# EAGLE design Sega Master System Quick Solder BIOS v1p1 (EAGLE 9.6.2)
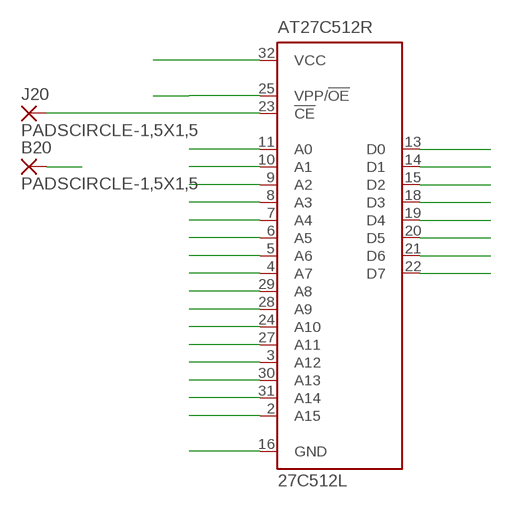
[diagram p0: schematic, sheet 1]

## Parts
AT27C512R  27C512L  [PLCC-32]
B20  PADSCIRCLE-1,5X1,5  [CIRCLE-1,5X1,5]
J20  PADSCIRCLE-1,5X1,5  [CIRCLE-1,5X1,5]

## Nets
A0: AT27C512R.11(A0)
A1: AT27C512R.10(A1)
A2: AT27C512R.9(A2)
A3: AT27C512R.8(A3)
A4: AT27C512R.7(A4)
A5: AT27C512R.6(A5)
A6: AT27C512R.5(A6)
A7: AT27C512R.4(A7)
A8: AT27C512R.29(A8)
A9: AT27C512R.28(A9)
A10: AT27C512R.24(A10)
A11: AT27C512R.27(A11)
A12: AT27C512R.3(A12)
A13: AT27C512R.30(A13)
A14: AT27C512R.31(A14)
A15: AT27C512R.2(A15)
CE-B20: B20.1(P)
CE-J20: AT27C512R.23(!CE) J20.1(P)
GND: AT27C512R.16(GND)
O0: AT27C512R.13(D0)
O1: AT27C512R.14(D1)
O2: AT27C512R.15(D2)
O3: AT27C512R.18(D3)
O4: AT27C512R.19(D4)
O5: AT27C512R.20(D5)
O6: AT27C512R.21(D6)
O7: AT27C512R.22(D7)
OE/VPP: AT27C512R.25(VPP/!OE)
VCC: AT27C512R.32(VCC)

## Library data of the parts
AT27C512R = Consoles Unleashed Eagle Parts Library:27*512: CMOS EPROM 512 K (64 K x 8); MPN: M27C512-90C1; OC_FARNELL: 1218315; OC_NEWARK: 24M5090
B20 J20 = Consoles Unleashed Eagle Parts Library:PADS: PADS connect wires to PCB

## Board
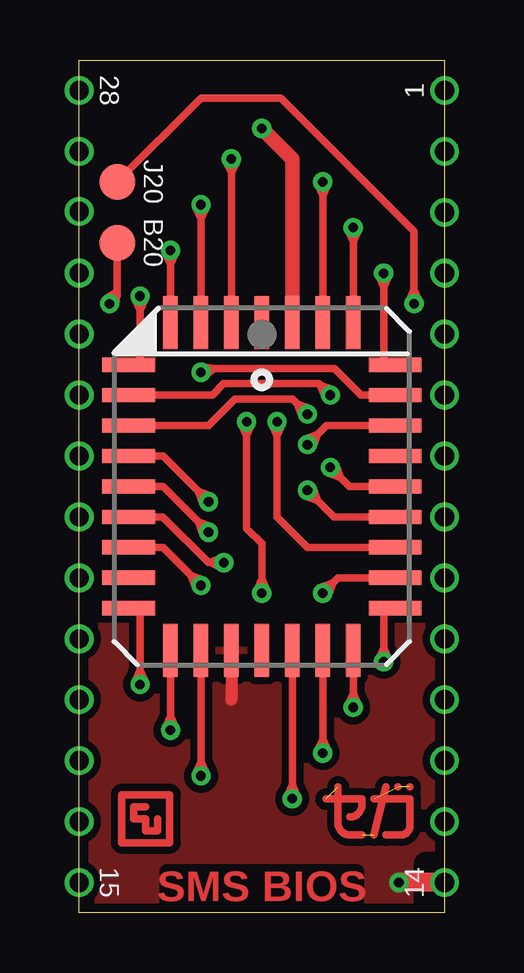
[diagram p1: board, top side]
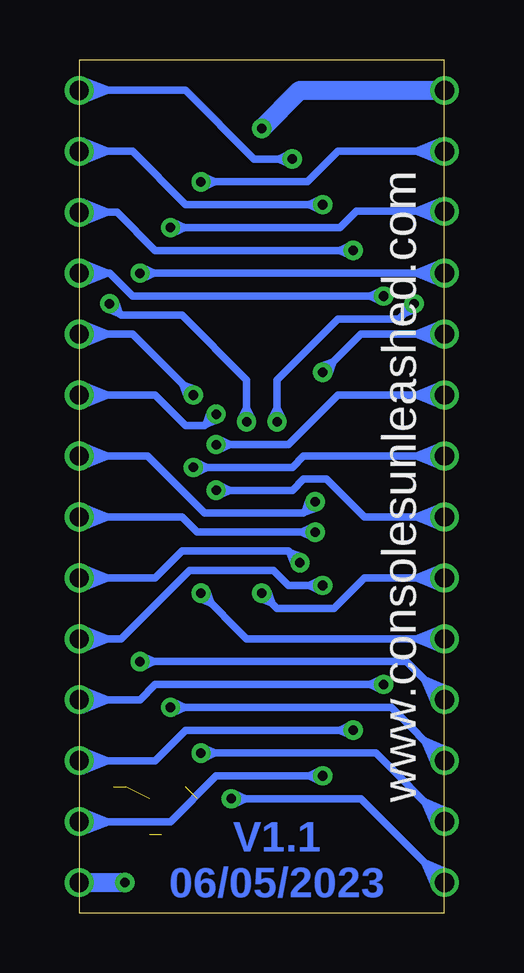
[diagram p2: board, bottom side, seen from below]

Size 15.24 x 35.56 mm. Coordinates in mm from the lower left corner, seen from the top.
Outline: 0,35.56 15.24,35.56 15.24,0 0,0 0,35.56
Copper layers (1*16): Top 0.035559375mm / dielectric 1.6mm / Bottom 0.035559375mm
Design rules "oshpark-2layer *": minimum track width 6mil, minimum drill 10mil, track to track 6mil, track to pad 6mil, pad to pad 6mil, via to via 6mil, smd to smd 6mil, copper to edge 15mil, drill to drill 6mil, minimum pad ring 5mil, minimum via ring 5mil, stop-mask expansion 2.5mil, vias tented up to drill 0.7mm, thermal gap 12mil

### Footprints (pad centres in the part's own frame; a part is rotated, then mirrored left to right if it is on the bottom)
PLCC-32 = smd 2.2 x 0.6: 1 -6.83,0; 2 -6.83,-1.27; 3 -6.83,-2.54; 4 -6.83,-3.81; 14 6.83,-3.81; 15 6.83,-2.54; 16 6.83,-1.27; 17 6.83,0; 18 6.83,1.27; 19 6.83,2.54; 20 6.83,3.81; 30 -6.83,3.81; 31 -6.83,2.54; 32 -6.83,1.27 | smd 0.6 x 2.2: 5 -5.08,-5.56; 6 -3.81,-5.56; 7 -2.54,-5.56; 8 -1.27,-5.56; 9 0,-5.56; 10 1.27,-5.56; 11 2.54,-5.56; 12 3.81,-5.56; 13 5.08,-5.56; 21 5.08,5.56; 22 3.81,5.56; 23 2.54,5.56; 24 1.27,5.56; 25 0,5.56; 26 -1.27,5.56; 27 -2.54,5.56; 28 -3.81,5.56; 29 -5.08,5.56
CIRCLE-1,5X1,5 = smd 1.5 x 1.5: 1 0,0

### Placement (x,y rotation side)
AT27C512R  7.62,17.78 270 top
B20  1.59,27.94 0 top
J20  1.59,30.48 0 top

### Tracks (layer width: path | path; a pad name or v marks a point on that pad's centre or on a via)
A0  (via drill 0.4 pad 0.8, 0.8 pad 1.2)
  Top 0.305: v5.08,13.65 3.49,15.24 AT27C512R.11 | v5.08,13.65 4.85,13.56 4.66,14.08 5.17,13.88 v5.08,13.65
  Bottom 0.305: v15.24,11.43 13.49,11.43 10.64,14.29 7.14,14.29 6.51,13.65 v5.08,13.65 | v5.08,13.65 5.18,13.88 5.68,13.65 5.18,13.43 v5.08,13.65 | v15.24,11.43 15.07,11.02 14.04,11.43 15.07,11.85 v15.24,11.43
A1  (via drill 0.4 pad 0.8, 0.8 pad 1.2)
  Top 0.305: v6.03,14.61 5.39,14.61 3.49,16.51 AT27C512R.10 | v6.03,14.61 5.93,14.38 5.43,14.61 5.93,14.83 v6.03,14.61
  Bottom 0.305: v15.24,13.97 12.06,13.97 10.95,15.08 6.51,15.08 v6.03,14.61 | v6.03,14.61 5.95,14.84 6.46,15.03 6.26,14.52 v6.03,14.61 | v15.24,13.97 15.07,13.55 14.04,13.97 15.07,14.38 v15.24,13.97
A2  (via drill 0.4 pad 0.8, 0.8 pad 1.2)
  Top 0.305: v5.4,15.88 3.49,17.78 AT27C512R.9 | v5.4,15.88 5.17,15.79 4.97,16.3 5.49,16.11 v5.4,15.88
  Bottom 0.305: v15.24,16.51 10.95,16.51 10.32,15.88 v5.4,15.88 | v5.4,15.88 5.5,16.1 6,15.88 5.5,15.65 v5.4,15.88 | v15.24,16.51 15.07,16.09 14.04,16.51 15.07,16.93 v15.24,16.51
A3  (via drill 0.4 pad 0.8, 0.8 pad 1.2)
  Top 0.305: v5.4,17.14 3.49,19.05 AT27C512R.8 | v5.4,17.14 5.17,17.06 4.97,17.57 5.49,17.38 v5.4,17.14
  Bottom 0.305: v15.24,19.05 12.38,19.05 10,16.67 5.87,16.67 v5.4,17.14 | v5.4,17.14 5.63,17.23 5.82,16.72 5.31,16.91 v5.4,17.14 | v15.24,19.05 15.07,18.64 14.04,19.05 15.07,19.46 v15.24,19.05
A4  (via drill 0.4 pad 0.8, 0.8 pad 1.2)
  Top 0.305: v9.53,20.8 8.89,21.43 6.51,21.43 5.4,20.32 AT27C512R.7 | v9.53,20.8 9.29,20.71 9.1,21.22 9.61,21.03 v9.53,20.8
  Bottom 0.305: v15.24,21.59 12.06,21.59 10.79,20.32 10,20.32 v9.53,20.8 | v9.53,20.8 9.76,20.88 9.95,20.37 9.44,20.57 v9.53,20.8 | v15.24,21.59 15.07,21.18 14.04,21.59 15.07,22 v15.24,21.59
A5  (via drill 0.4 pad 0.8, 0.8 pad 1.2)
  Top 0.305: v10.48,21.59 10,22.07 6.03,22.07 5.56,21.59 AT27C512R.6 | v10.48,21.59 10.25,21.5 10.05,22.01 10.56,21.82 v10.48,21.59
  Bottom 0.305: v15.24,24.13 13.02,24.13 v10.48,21.59 | v10.48,21.59 10.39,21.82 10.9,22.01 10.71,21.5 v10.48,21.59 | v15.24,24.13 15.07,23.71 14.04,24.13 15.07,24.55 v15.24,24.13
A6  (via drill 0.4 pad 0.8, 0.8 pad 1.2)
  Top 0.305: AT27C512R.5 2.54,22.86 v2.54,25.72 | v2.54,25.72 2.77,25.61 2.54,25.12 2.31,25.61 v2.54,25.72
  Bottom 0.305: v15.24,26.67 13.97,26.67 13.02,25.72 v2.54,25.72 | v2.54,25.72 2.64,25.94 3.14,25.72 2.64,25.49 v2.54,25.72 | v15.24,26.67 15.07,26.25 14.04,26.67 15.07,27.09 v15.24,26.67
A7  (via drill 0.4 pad 0.8, 0.8 pad 1.2)
  Top 0.305: AT27C512R.4 v3.81,27.62 | v3.81,27.62 4.04,27.52 3.81,27.02 3.58,27.52 v3.81,27.62
  Bottom 0.305: v15.24,29.21 13.65,29.21 12.06,27.62 v3.81,27.62 | v3.81,27.62 3.91,27.85 4.41,27.62 3.91,27.4 v3.81,27.62 | v15.24,29.21 15.07,28.8 14.04,29.21 15.07,29.62 v15.24,29.21
A8  (via drill 0.4 pad 0.8, 0.8 pad 1.2)
  Top 0.305: AT27C512R.29 12.7,22.86 v12.7,26.67 | v12.7,26.67 12.93,26.57 12.7,26.07 12.47,26.57 v12.7,26.67
  Bottom 0.305: v12.7,26.67 v0,26.67 | v12.7,26.67 12.6,26.44 12.1,26.67 12.6,26.9 v12.7,26.67 | v0,26.67 0.17,27.09 1.2,26.67 0.17,26.25 v0,26.67
A9  (via drill 0.4 pad 0.8, 0.8 pad 1.2)
  Top 0.305: AT27C512R.28 11.75,21.59 10.64,22.7 5.24,22.7 v5.08,22.54 | v5.08,22.54 5.12,22.79 5.66,22.7 5.24,22.35 v5.08,22.54
  Bottom 0.305: v5.08,22.54 3.49,24.13 v0,24.13 | v5.08,22.54 4.85,22.45 4.66,22.97 5.17,22.77 v5.08,22.54 | v0,24.13 0.17,24.55 1.2,24.13 0.17,23.71 v0,24.13
A10  (via drill 0.4 pad 0.8, 0.8 pad 1.2)
  Top 0.305: AT27C512R.24 10.64,16.51 v9.53,17.62 | v9.53,17.62 9.76,17.71 9.95,17.2 9.44,17.39 v9.53,17.62
  Bottom 0.305: v9.53,17.62 6.35,17.62 5.87,18.1 4.92,18.1 3.33,16.51 v0,16.51 | v9.53,17.62 9.42,17.4 8.93,17.62 9.42,17.85 v9.53,17.62 | v0,16.51 0.17,16.93 1.2,16.51 0.17,16.09 v0,16.51
A11  (via drill 0.4 pad 0.8, 0.8 pad 1.2)
  Top 0.305: AT27C512R.27 10.32,20.32 v9.53,19.53 | v9.53,19.53 9.44,19.76 9.95,19.95 9.76,19.44 v9.53,19.53
  Bottom 0.305: v9.53,19.53 6.51,19.53 4.45,21.59 v0,21.59 | v9.53,19.53 9.42,19.3 8.93,19.53 9.42,19.75 v9.53,19.53 | v0,21.59 0.17,22 1.2,21.59 0.17,21.18 v0,21.59
A12  (via drill 0.4 pad 0.8, 0.8 pad 1.2)
  Top 0.305: AT27C512R.3 v5.08,29.53 | v5.08,29.53 5.31,29.43 5.08,28.93 4.85,29.43 v5.08,29.53
  Bottom 0.305: v15.24,31.75 13.02,31.75 10.79,29.53 v5.08,29.53 | v5.08,29.53 5.18,29.75 5.68,29.53 5.18,29.3 v5.08,29.53 | v15.24,31.75 15.07,31.34 14.04,31.75 15.07,32.16 v15.24,31.75
A13  (via drill 0.4 pad 0.8, 0.8 pad 1.2)
  Top 0.305: v11.43,28.57 AT27C512R.30 | v11.43,28.57 11.66,28.47 11.43,27.98 11.2,28.47 v11.43,28.57
  Bottom 0.305: v11.43,28.57 4.36,28.57 3.68,29.25 1.2,29.25 | 1.2,29.25 v0,29.25 | v11.43,28.57 11.33,28.35 10.83,28.57 11.33,28.8 v11.43,28.57 | 1.2,29.25 0.17,29.66 v0,29.25 | 1.2,29.25 0.17,28.84 v0,29.25
A14  (via drill 0.4 pad 0.8, 0.8 pad 1.2)
  Top 0.305: AT27C512R.31 v10.16,30.48 | v10.16,30.48 10.39,30.38 10.16,29.88 9.93,30.38 v10.16,30.48
  Bottom 0.305: v10.16,30.48 5.71,30.48 4.45,31.75 v0,31.75 | v10.16,30.48 10.06,30.25 9.56,30.48 10.06,30.71 v10.16,30.48 | v0,31.75 0.17,32.16 1.2,31.75 0.17,31.34 v0,31.75
A15  (via drill 0.4 pad 0.8, 0.8 pad 1.2)
  Top 0.305: AT27C512R.2 v6.35,31.43 | v6.35,31.43 6.58,31.33 6.35,30.83 6.12,31.33 v6.35,31.43
  Bottom 0.305: v6.35,31.43 7.94,31.43 10.79,34.29 v15.24,34.29 | v6.35,31.43 6.45,31.66 6.95,31.43 6.45,31.21 v6.35,31.43 | v15.24,34.29 15.07,33.88 14.04,34.29 15.07,34.7 v15.24,34.29
AVOID
  cutout Top: 3.17,12.06 7.62,12.06 7.62,20.32 3.17,20.32
  cutout Top: 15.24,2.54 14.45,2.54 arc90 13.97,2.06 13.97,0 15.24,0
CE-B20  (via drill 0.4 pad 0.8, 0.8 pad 1.2)
  Top 0.305: v6.99,20.48 6.99,16.03 7.62,15.4 v7.62,13.34 | v1.27,25.4 1.59,25.72 B20.1 | v7.62,13.34 7.39,13.44 7.62,13.94 7.85,13.44 v7.62,13.34 | v6.99,20.48 7.21,20.38 6.99,19.88 6.76,20.38 v6.99,20.48 | v1.27,25.4 1.13,25.61 1.59,25.91 1.51,25.37 v1.27,25.4
  Bottom 0.305: v0,13.97 3.33,13.97 4.6,12.7 6.99,12.7 v7.62,13.34 | v6.99,20.48 6.99,22.23 4.45,24.77 1.91,24.77 v1.27,25.4 | v0,13.97 0.17,14.38 1.2,13.97 0.17,13.55 v0,13.97 | v7.62,13.34 7.71,13.1 7.2,12.91 7.39,13.42 v7.62,13.34 | v6.99,20.48 6.76,20.58 6.99,21.08 7.21,20.58 v6.99,20.48 | v1.27,25.4 1.5,25.49 1.69,24.98 1.18,25.17 v1.27,25.4
CE-J20  (via drill 0.4 pad 0.8)
  Top 0.305: AT27C512R.23 9.53,15.24 8.26,16.51 v8.26,20.48 | v13.97,25.4 13.97,28.42 8.41,33.97 5.08,33.97 J20.1 | v8.26,20.48 8.48,20.38 8.26,19.88 8.03,20.38 v8.26,20.48 | v13.97,25.4 13.74,25.5 13.97,26 14.2,25.5 v13.97,25.4
  Bottom 0.305: v13.97,25.4 13.49,24.92 10.95,24.92 8.26,22.23 v8.26,20.48 | v8.26,20.48 8.03,20.58 8.26,21.08 8.48,20.58 v8.26,20.48 | v13.97,25.4 14.06,25.17 13.55,24.98 13.74,25.49 v13.97,25.4
GND  (via drill 0.4 pad 0.8, 0.8 pad 1.2)
  Top 0.508: AT27C512R.16 6.35,8.89
  Top 0.8: v15.24,1.27 v13.34,1.27
  Bottom 0.8: v15.24,1.27 v13.34,1.27
  pour Top (isolate 0.305): 15.24,35.56 0,35.56 0,0 15.24,0
LOGO
  Top 0.305: 2.78,4.43 2.28,4.43 2.28,3.94 2.78,3.94 2.78,3.44 3.28,3.44 3.28,3.94 | 1.78,4.93 1.78,2.94 3.78,2.94 3.78,4.93 1.78,4.93
O0  (via drill 0.4 pad 0.8, 0.8 pad 1.2)
  Top 0.305: v2.54,9.53 2.54,12.7 AT27C512R.13 | v2.54,9.53 2.31,9.63 2.54,10.12 2.77,9.63 v2.54,9.53
  Bottom 0.305: v15.24,8.89 12.7,8.89 12.06,9.53 v2.54,9.53 | v2.54,9.53 2.64,9.75 3.14,9.53 2.64,9.3 v2.54,9.53 | v15.24,8.89 15.07,8.47 14.04,8.89 15.07,9.3 v15.24,8.89
O1  (via drill 0.4 pad 0.8, 0.8 pad 1.2)
  Top 0.305: AT27C512R.14 v3.81,7.62 | v3.81,7.62 3.58,7.72 3.81,8.22 4.04,7.72 v3.81,7.62
  Bottom 0.305: v15.24,6.35 12.06,6.35 10.79,7.62 v3.81,7.62 | v3.81,7.62 3.91,7.85 4.41,7.62 3.91,7.39 v3.81,7.62 | v15.24,6.35 15.07,5.93 14.04,6.35 15.07,6.76 v15.24,6.35
O2  (via drill 0.4 pad 0.8, 0.8 pad 1.2)
  Top 0.305: AT27C512R.15 v5.08,5.71 | v5.08,5.71 4.85,5.82 5.08,6.32 5.31,5.82 v5.08,5.71
  Bottom 0.305: v15.24,3.81 11.43,3.81 9.53,5.71 v5.08,5.71 | v5.08,5.71 5.18,5.94 5.68,5.71 5.18,5.49 v5.08,5.71 | v15.24,3.81 15.07,3.4 14.04,3.81 15.07,4.22 v15.24,3.81
O3  (via drill 0.4 pad 0.8, 0.8 pad 1.2)
  Top 0.305: AT27C512R.18 v8.89,4.76 | v8.89,4.76 8.66,4.87 8.89,5.36 9.12,4.87 v8.89,4.76
  Bottom 0.305: v8.89,4.76 3.49,4.76 v0,1.27 | v8.89,4.76 8.79,4.54 8.29,4.76 8.79,4.99 v8.89,4.76 | v0,1.27 -0.18,1.68 0.85,2.12 0.41,1.09 v0,1.27
O4  (via drill 0.4 pad 0.8, 0.8 pad 1.2)
  Top 0.305: AT27C512R.19 v10.16,6.67 | v10.16,6.67 9.93,6.77 10.16,7.27 10.39,6.77 v10.16,6.67
  Bottom 0.305: v0,3.81 2.86,6.67 v10.16,6.67 10.06,6.44 9.56,6.67 10.06,6.89 | v0,3.81 -0.18,4.22 0.85,4.66 0.41,3.63 v0,3.81
O5  (via drill 0.4 pad 0.8, 0.8 pad 1.2)
  Top 0.305: AT27C512R.20 v11.43,8.57 | v11.43,8.57 11.2,8.68 11.43,9.17 11.66,8.68 v11.43,8.57
  Bottom 0.305: v11.43,8.57 2.22,8.57 v0,6.35 | v11.43,8.57 11.33,8.35 10.83,8.57 11.33,8.8 v11.43,8.57 | v0,6.35 -0.18,6.76 0.85,7.2 0.41,6.17 v0,6.35
O6  (via drill 0.4 pad 0.8, 0.8 pad 1.2)
  Top 0.305: v12.7,10.48 12.7,12.7 AT27C512R.21 | v12.7,10.48 12.47,10.58 12.7,11.08 12.93,10.58 v12.7,10.48
  Bottom 0.305: v12.7,10.48 1.59,10.48 v0,8.89 | v12.7,10.48 12.6,10.7 12.1,10.48 12.6,10.25 v12.7,10.48 | v0,8.89 -0.18,9.3 0.85,9.74 0.41,8.71 v0,8.89
O7  (via drill 0.4 pad 0.8, 0.8 pad 1.2)
  Top 0.305: AT27C512R.22 10.79,13.97 v10.16,13.34 | v10.16,13.34 10.07,13.57 10.58,13.76 10.39,13.25 v10.16,13.34
  Bottom 0.305: v0,11.43 8.26,11.43 v10.16,13.34 | v10.16,13.34 10.25,13.1 9.74,12.91 9.93,13.42 v10.16,13.34 | v0,11.43 0.17,11.85 1.2,11.43 0.17,11.02 v0,11.43
OE/VPP  (via drill 0.4 pad 0.8, 0.8 pad 1.2)
  Top 0.305: AT27C512R.25 11.27,17.78 v10.48,18.57 | v10.48,18.57 10.71,18.66 10.9,18.15 10.39,18.34 v10.48,18.57
  Bottom 0.305: v10.48,18.57 6.35,18.57 5.87,19.05 v0,19.05 | v10.48,18.57 10.38,18.35 9.88,18.57 10.38,18.8 v10.48,18.57 | v0,19.05 0.17,19.46 1.2,19.05 0.17,18.64 v0,19.05
SEGA  (4 unrouted)
  Top 0.305: 13.29,5.25 | 13.79,5.25 | 12.67,4.75 12.79,5.25 12.67,4.75 | 12.67,4.75 12.79,4.75 | 12.79,4.75 13.79,4.75 13.79,3.63 arc-90 13.42,3.25 12.79,3.25 | 12.67,4.75 12.29,3.25 | 12.29,4.75 12.67,4.75 | 12.67,4.75 12.79,4.75 | 10.29,4.75 11.79,4.75 11.79,4.5 arc-90 11.29,4 | 10.79,5.25 10.79,3.75 arc90 11.29,3.25 11.79,3.25
VCC  (via drill 0.4 pad 0.8, 0.8 pad 1.2)
  Top 0.61: AT27C512R.32 8.89,31.43 v7.62,32.7
  Bottom 0.8: v7.62,32.7 6.03,34.29 v0,34.29

### Text on the board
Top: SMS BIOS
Bottom: V1.1 | 06/05/2023
tNames: 28 | 1 | J20 | B20 | 15 | 14
bNames: www.consolesunleashed.com